# EasyEDA schematic SCH_低频电子线路电路_2025-10-19.json

## Sheets
1 Sheet_1: TITLE: Sheet_1; REV: 1.0; Date: 2025-10-13; Sheet: 1/1; Drawn By: mingtianjiufangjia; Company: Your Company
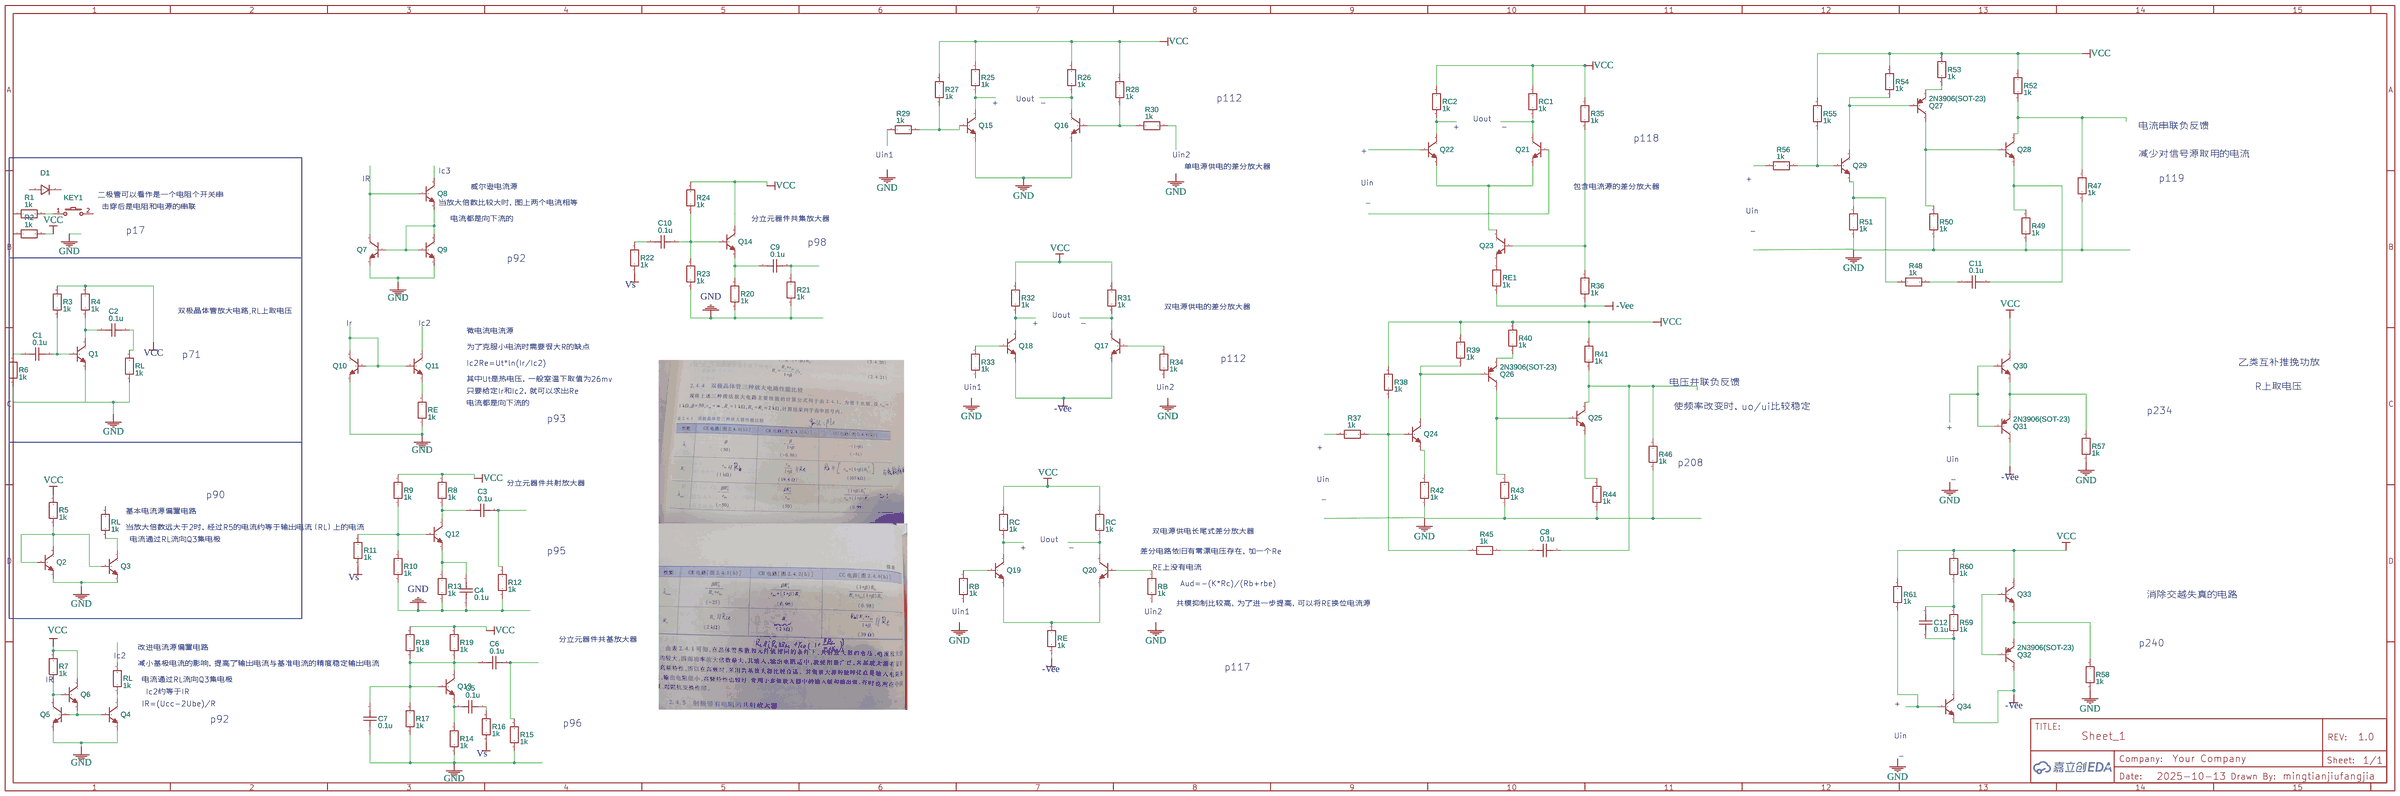
[diagram p0: Sheet_1]
2 Sheet_2: TITLE: Sheet_2; Date: 2025-10-14
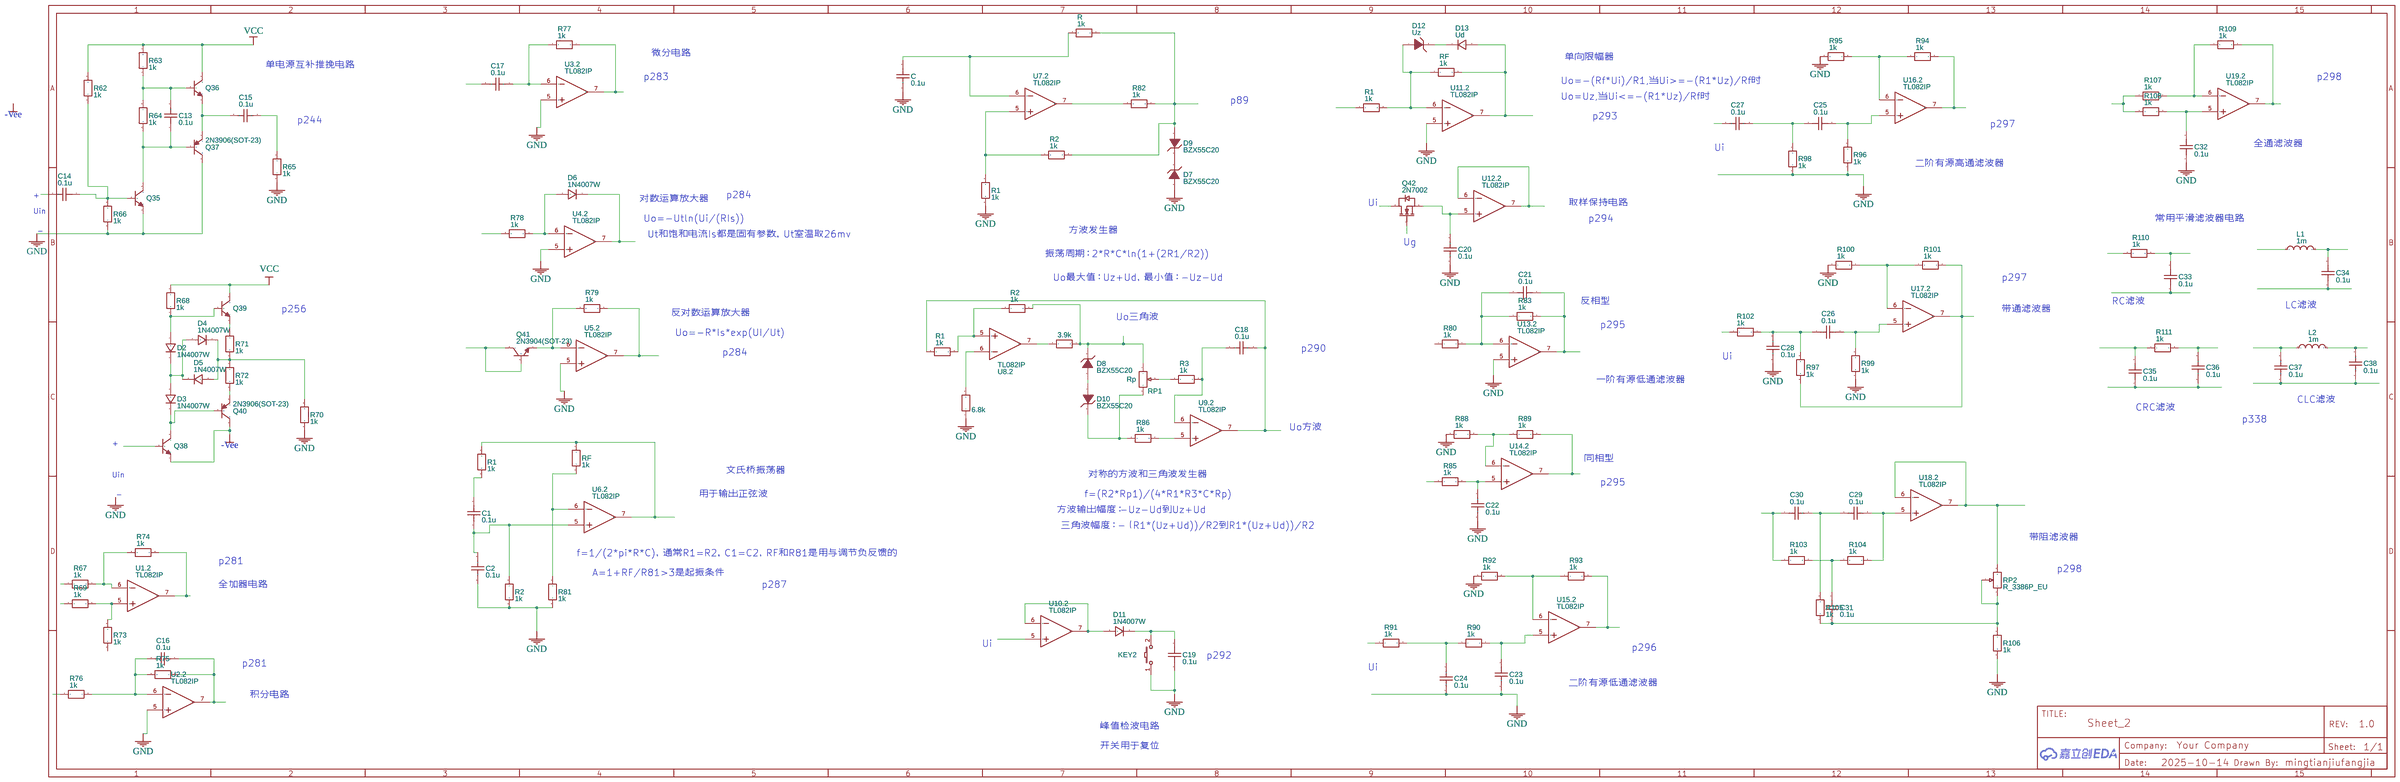
[diagram p1: Sheet_2]

## Parts
sheet Sheet_1
C1  0.1u  [C0603]
C2  0.1u  [C0603]
C3  0.1u  [C0603]
C4  0.1u  [C0603]
C5  0.1u  [C0603]
C6  0.1u  [C0603]
C7  0.1u  [C0603]
C8  0.1u  [C0603]
C9  0.1u  [C0603]
C10  0.1u  [C0603]
C11  0.1u  [C0603]
C12  0.1u  [C0603]
D1  1N4007W  [SOD-123_L2.8-W1.8-LS3.7-RD]
KEY1  K2-3.6×6.1_SMD  [KEY-SMD_2P-L6.2-W3.6-LS8.0]
Q1  2N3904(SOT-23)  [SOT-23-3_L2.9-W1.3-P1.90-LS2.4-TR]
Q2  2N3904(SOT-23)  [SOT-23-3_L2.9-W1.3-P1.90-LS2.4-TR]
Q3  2N3904(SOT-23)  [SOT-23-3_L2.9-W1.3-P1.90-LS2.4-TR]
Q4  2N3904(SOT-23)  [SOT-23-3_L2.9-W1.3-P1.90-LS2.4-TR]
Q5  2N3904(SOT-23)  [SOT-23-3_L2.9-W1.3-P1.90-LS2.4-TR]
Q6  2N3904(SOT-23)  [SOT-23-3_L2.9-W1.3-P1.90-LS2.4-TR]
Q7  2N3904(SOT-23)  [SOT-23-3_L2.9-W1.3-P1.90-LS2.4-TR]
Q8  2N3904(SOT-23)  [SOT-23-3_L2.9-W1.3-P1.90-LS2.4-TR]
Q9  2N3904(SOT-23)  [SOT-23-3_L2.9-W1.3-P1.90-LS2.4-TR]
Q10  2N3904(SOT-23)  [SOT-23-3_L2.9-W1.3-P1.90-LS2.4-TR]
Q11  2N3904(SOT-23)  [SOT-23-3_L2.9-W1.3-P1.90-LS2.4-TR]
Q12  2N3904(SOT-23)  [SOT-23-3_L2.9-W1.3-P1.90-LS2.4-TR]
Q13  2N3904(SOT-23)  [SOT-23-3_L2.9-W1.3-P1.90-LS2.4-TR]
Q14  2N3904(SOT-23)  [SOT-23-3_L2.9-W1.3-P1.90-LS2.4-TR]
Q15  2N3904(SOT-23)  [SOT-23-3_L2.9-W1.3-P1.90-LS2.4-TR]
Q16  2N3904(SOT-23)  [SOT-23-3_L2.9-W1.3-P1.90-LS2.4-TR]
Q17  2N3904(SOT-23)  [SOT-23-3_L2.9-W1.3-P1.90-LS2.4-TR]
Q18  2N3904(SOT-23)  [SOT-23-3_L2.9-W1.3-P1.90-LS2.4-TR]
Q19  2N3904(SOT-23)  [SOT-23-3_L2.9-W1.3-P1.90-LS2.4-TR]
Q20  2N3904(SOT-23)  [SOT-23-3_L2.9-W1.3-P1.90-LS2.4-TR]
Q21  2N3904(SOT-23)  [SOT-23-3_L2.9-W1.3-P1.90-LS2.4-TR]
Q22  2N3904(SOT-23)  [SOT-23-3_L2.9-W1.3-P1.90-LS2.4-TR]
Q23  2N3904(SOT-23)  [SOT-23-3_L2.9-W1.3-P1.90-LS2.4-TR]
Q24  2N3904(SOT-23)  [SOT-23-3_L2.9-W1.3-P1.90-LS2.4-TR]
Q25  2N3904(SOT-23)  [SOT-23-3_L2.9-W1.3-P1.90-LS2.4-TR]
Q26  2N3906(SOT-23)  [SOT-23-3_L2.9-W1.6-P1.90-LS2.8-TR-CW]
Q27  2N3906(SOT-23)  [SOT-23-3_L2.9-W1.6-P1.90-LS2.8-TR-CW]
Q28  2N3904(SOT-23)  [SOT-23-3_L2.9-W1.3-P1.90-LS2.4-TR]
Q29  2N3904(SOT-23)  [SOT-23-3_L2.9-W1.3-P1.90-LS2.4-TR]
Q30  2N3904(SOT-23)  [SOT-23-3_L2.9-W1.3-P1.90-LS2.4-TR]
Q31  2N3906(SOT-23)  [SOT-23-3_L2.9-W1.6-P1.90-LS2.8-TR-CW]
Q32  2N3906(SOT-23)  [SOT-23-3_L2.9-W1.6-P1.90-LS2.8-TR-CW]
Q33  2N3904(SOT-23)  [SOT-23-3_L2.9-W1.3-P1.90-LS2.4-TR]
Q34  2N3904(SOT-23)  [SOT-23-3_L2.9-W1.3-P1.90-LS2.4-TR]
R1  1k  [R0603]
R2  1k  [R0603]
R3  1k  [R0603]
R4  1k  [R0603]
R5  1k  [R0603]
R6  1k  [R0603]
R7  1k  [R0603]
R8  1k  [R0603]
R9  1k  [R0603]
R10  1k  [R0603]
R11  1k  [R0603]
R12  1k  [R0603]
R13  1k  [R0603]
R14  1k  [R0603]
R15  1k  [R0603]
R16  1k  [R0603]
R17  1k  [R0603]
R18  1k  [R0603]
R19  1k  [R0603]
R20  1k  [R0603]
R21  1k  [R0603]
R22  1k  [R0603]
R23  1k  [R0603]
R24  1k  [R0603]
R25  1k  [R0603]
R26  1k  [R0603]
R27  1k  [R0603]
R28  1k  [R0603]
R29  1k  [R0603]
R30  1k  [R0603]
R31  1k  [R0603]
R32  1k  [R0603]
R33  1k  [R0603]
R34  1k  [R0603]
R35  1k  [R0603]
R36  1k  [R0603]
R37  1k  [R0603]
R38  1k  [R0603]
R39  1k  [R0603]
R40  1k  [R0603]
R41  1k  [R0603]
R42  1k  [R0603]
R43  1k  [R0603]
R44  1k  [R0603]
R45  1k  [R0603]
R46  1k  [R0603]
R47  1k  [R0603]
R48  1k  [R0603]
R49  1k  [R0603]
R50  1k  [R0603]
R51  1k  [R0603]
R52  1k  [R0603]
R53  1k  [R0603]
R54  1k  [R0603]
R55  1k  [R0603]
R56  1k  [R0603]
R57  1k  [R0603]
R58  1k  [R0603]
R59  1k  [R0603]
R60  1k  [R0603]
R61  1k  [R0603]
RB  1k  [R0603]
RB#2  1k  [R0603]
RC  1k  [R0603]
RC1  1k  [R0603]
RC2  1k  [R0603]
RC#2  1k  [R0603]
RE  1k  [R0603]
RE1  1k  [R0603]
RE#2  1k  [R0603]
RL  1k  [R0603]
RL#2  1k  [R0603]
RL#3  1k  [R0603]
sheet Sheet_2
C  0.1u  [C0603]
C1#2  0.1u  [C0603]
C2#2  0.1u  [C0603]
C13  0.1u  [C0603]
C14  0.1u  [C0603]
C15  0.1u  [C0603]
C16  0.1u  [C0603]
C17  0.1u  [C0603]
C18  0.1u  [C0603]
C19  0.1u  [C0603]
C20  0.1u  [C0603]
C21  0.1u  [C0603]
C22  0.1u  [C0603]
C23  0.1u  [C0603]
C24  0.1u  [C0603]
C25  0.1u  [C0603]
C26  0.1u  [C0603]
C27  0.1u  [C0603]
C28  0.1u  [C0603]
C29  0.1u  [C0603]
C30  0.1u  [C0603]
C31  0.1u  [C0603]
C32  0.1u  [C0603]
C33  0.1u  [C0603]
C34  0.1u  [C0603]
C35  0.1u  [C0603]
C36  0.1u  [C0603]
C37  0.1u  [C0603]
C38  0.1u  [C0603]
D2  1N4007W  [SOD-123_L2.8-W1.8-LS3.7-RD]
D3  1N4007W  [SOD-123_L2.8-W1.8-LS3.7-RD]
D4  1N4007W  [SOD-123_L2.8-W1.8-LS3.7-RD]
D5  1N4007W  [SOD-123_L2.8-W1.8-LS3.7-RD]
D6  1N4007W  [SOD-123_L2.8-W1.8-LS3.7-RD]
D7  BZX55C20  [DO-35_BD2.0-L4.2-P8.20-D0.5-R-RD]
D8  BZX55C20  [DO-35_BD2.0-L4.2-P8.20-D0.5-R-RD]
D9  BZX55C20  [DO-35_BD2.0-L4.2-P8.20-D0.5-R-RD]
D10  BZX55C20  [DO-35_BD2.0-L4.2-P8.20-D0.5-R-RD]
D11  1N4007W  [SOD-123_L2.8-W1.8-LS3.7-RD]
D12  Uz  [DO-35_BD2.0-L4.2-P8.20-D0.5-R-RD]
D13  Ud  [SOD-123_L2.8-W1.8-LS3.7-RD]
KEY2  K2-3.6×6.1_SMD  [KEY-SMD_2P-L6.2-W3.6-LS8.0]
L1  1m  [L0603]
L2  1m  [L0603]
Q35  2N3904(SOT-23)  [SOT-23-3_L2.9-W1.3-P1.90-LS2.4-TR]
Q36  2N3904(SOT-23)  [SOT-23-3_L2.9-W1.3-P1.90-LS2.4-TR]
Q37  2N3906(SOT-23)  [SOT-23-3_L2.9-W1.6-P1.90-LS2.8-TR-CW]
Q38  2N3904(SOT-23)  [SOT-23-3_L2.9-W1.3-P1.90-LS2.4-TR]
Q39  2N3904(SOT-23)  [SOT-23-3_L2.9-W1.3-P1.90-LS2.4-TR]
Q40  2N3906(SOT-23)  [SOT-23-3_L2.9-W1.6-P1.90-LS2.8-TR-CW]
Q41  2N3904(SOT-23)  [SOT-23-3_L2.9-W1.3-P1.90-LS2.4-TR]
Q42  2N7002  [SOT-23_L2.9-W1.3-P0.95-LS2.4-BR]
R  1k  [R0603]
R1#2  1k  [R0603]
R1#3  1k  [R0603]
R1#4  1k  [R0603]
R1#5  1k  [R0603]
R2#2  1k  [R0603]
R2#3  1k  [R0603]
R2#4  1k  [R0603]
R3#2  1k  [R0603]
R62  1k  [R0603]
R63  1k  [R0603]
R64  1k  [R0603]
R65  1k  [R0603]
R66  1k  [R0603]
R67  1k  [R0603]
R68  1k  [R0603]
R69  1k  [R0603]
R70  1k  [R0603]
R71  1k  [R0603]
R72  1k  [R0603]
R73  1k  [R0603]
R74  1k  [R0603]
R75  1k  [R0603]
R76  1k  [R0603]
R77  1k  [R0603]
R78  1k  [R0603]
R79  1k  [R0603]
R80  1k  [R0603]
R81  1k  [R0603]
R82  1k  [R0603]
R83  1k  [R0603]
R84  3.9k  [R0603]
R85  1k  [R0603]
R86  1k  [R0603]
R87  6.8k  [R0603]
R88  1k  [R0603]
R89  1k  [R0603]
R90  1k  [R0603]
R91  1k  [R0603]
R92  1k  [R0603]
R93  1k  [R0603]
R94  1k  [R0603]
R95  1k  [R0603]
R96  1k  [R0603]
R97  1k  [R0603]
R98  1k  [R0603]
R99  1k  [R0603]
R100  1k  [R0603]
R101  1k  [R0603]
R102  1k  [R0603]
R103  1k  [R0603]
R104  1k  [R0603]
R105  1k  [R0603]
R106  1k  [R0603]
R107  1k  [R0603]
R108  1k  [R0603]
R109  1k  [R0603]
R110  1k  [R0603]
R111  1k  [R0603]
RF  1k  [R0603]
RF#2  1k  [R0603]
RP1  Rp  [RES-ADJ-TH_3386P]
RP2  R_3386P_EU  [RES-ADJ-TH_3386P]
U1  TL082IP  [DIP-8_L9.6-W6.4-P2.54-LS7.6-BL-1]  (section 2)
U2  TL082IP  [DIP-8_L9.6-W6.4-P2.54-LS7.6-BL-1]  (section 2)
U3  TL082IP  [DIP-8_L9.6-W6.4-P2.54-LS7.6-BL-1]  (section 2)
U4  TL082IP  [DIP-8_L9.6-W6.4-P2.54-LS7.6-BL-1]  (section 2)
U5  TL082IP  [DIP-8_L9.6-W6.4-P2.54-LS7.6-BL-1]  (section 2)
U6  TL082IP  [DIP-8_L9.6-W6.4-P2.54-LS7.6-BL-1]  (section 2)
U7  TL082IP  [DIP-8_L9.6-W6.4-P2.54-LS7.6-BL-1]  (section 2)
U8  TL082IP  [DIP-8_L9.6-W6.4-P2.54-LS7.6-BL-1]  (section 2)
U9  TL082IP  [DIP-8_L9.6-W6.4-P2.54-LS7.6-BL-1]  (section 2)
U10  TL082IP  [DIP-8_L9.6-W6.4-P2.54-LS7.6-BL-1]  (section 2)
U11  TL082IP  [DIP-8_L9.6-W6.4-P2.54-LS7.6-BL-1]  (section 2)
U12  TL082IP  [DIP-8_L9.6-W6.4-P2.54-LS7.6-BL-1]  (section 2)
U13  TL082IP  [DIP-8_L9.6-W6.4-P2.54-LS7.6-BL-1]  (section 2)
U14  TL082IP  [DIP-8_L9.6-W6.4-P2.54-LS7.6-BL-1]  (section 2)
U15  TL082IP  [DIP-8_L9.6-W6.4-P2.54-LS7.6-BL-1]  (section 2)
U16  TL082IP  [DIP-8_L9.6-W6.4-P2.54-LS7.6-BL-1]  (section 2)
U17  TL082IP  [DIP-8_L9.6-W6.4-P2.54-LS7.6-BL-1]  (section 2)
U18  TL082IP  [DIP-8_L9.6-W6.4-P2.54-LS7.6-BL-1]  (section 2)
U19  TL082IP  [DIP-8_L9.6-W6.4-P2.54-LS7.6-BL-1]  (section 2)

## Library data of the parts
C C1 C1#2 C2 C2#2 C3-C38 = C_0603_US: Contributor: LCEDA_Lib
D1-D6 D11 D13 = 1N4007W: Supplier: LCSC; Supplier Part: C328592; Manufacturer: BLUE ROCKET; Contributor: LCEDA_Lib
KEY1 KEY2 = K2-3.6×6.1_SMD: Supplier Part: C118141; Supplier: LCSC; Manufacturer Part: K2-1107ST-A4SW-06; Contributor: LCEDA_Lib; 制造商: 韩国韩荣
Q1-Q25 Q28-Q30 Q33-Q36 Q38 Q39 Q41 = 2N3904(SOT-23): Supplier: LCSC; Manufacturer: KEC; Manufacturer Part: 2n3904S-RTK/PS; Supplier Part: C18536; Paste Type: SOT-23; Contributor: LCEDA_Lib
Q26 Q27 Q31 Q32 Q37 Q40 = 2N3906(SOT-23): Supplier: LCSC; Manufacturer: KEC; Manufacturer Part: 2N3906S-RTK/PS; Contributor: LCEDA_Lib; Supplier Part: C147294
R R1 R1#2-R1#5 R2 R2#2-R2#4 R3 R3#2 R4-R111 RB RB#2 RC RC1 RC2 RC#2 RE RE1 RE#2 RF RF#2 RL RL#2 RL#3 = R_0603_EU: Contributor: LCEDA_Lib
D7-D10 D12 = BZX55C20: Supplier: LCSC; Manufacturer: ST(先科); Supplier Part: C2526; JLCPCB Part Class: Extended Part
L1 L2 = L0603_US: Contributor: LCEDA_Lib
Q42 = 2N7002: Supplier: LCSC; Manufacturer: Nexperia; Manufacturer Part: 2N7002,215; image: //image.lceda.cn/szlcsc/C65189.jpg; Supplier Part: C65189; Paste Type: expand; Contributor: LCEDA_Lib
RP1 RP2 = R_3386P_EU: Supplier: LCSC; Contributor: LCEDA_Lib; Value(Ω): 10K
U1-U19 = TL082IP: subpart_no: 2; Supplier: LCSC; Supplier Part: C189972; Manufacturer: TI(德州仪器); JLCPCB Part Class: Extended Part

## Nets
-Vee: Q17.1(E) Q18.1(E) Q31.3(C) Q32.3(C) Q34.1(E) Q38.1(E) Q40.3(C) R36.1 RE1.2 RE#2.2
GND: C.2 C2#2.2 C4.1 C7.1 C19.1 C20.1 C22.2 C23.2 C24.2 C28.1 C32.1 D7.1(A) KEY2.1 Q1.1(E) Q2.1(E) Q3.1(E) Q4.1(E) Q5.1(E) Q7.1(E) Q9.1(E) Q10.1(E) Q15.1(E) Q16.1(E) Q35.1(E) Q37.3(C) R1#3.2 R2#2.2 R6.1 R10.1 R12.1 R13.1 R14.1 R15.1 R17.1 R20.1 R21.1 R23.1 R43.1 R44.1 R46.2 R47.2 R49.1 R50.1 R57.1 R58.1 R65.1 R66.1 R70.1 R81.2 R87.1 R88.1 R92.1 R95.1 R96.1 R98.1 R99.1 R100.1 R106.1 RE.1 RL.1 U2.5(2IN+) U3.5(2IN+) U4.5(2IN+) U5.5(2IN+) U11.5(2IN+) U13.5(2IN+)
VCC: Q6.3(C) Q14.3(C) Q30.3(C) Q33.3(C) Q36.3(C) Q39.3(C) R2.2 R3.2 R4.2 R5.2 R7.2 R8.2 R9.2 R18.2 R19.2 R24.2 R25.2 R26.2 R27.2 R28.2 R31.2 R32.2 R35.2 R38.2 R39.2 R40.2 R41.2 R52.2 R53.2 R54.2 R55.2 R60.2 R61.2 R62.2 R63.2 R68.2 RC.2 RC1.2 RC2.2 RC#2.2
Vs: R11.1 R16.1 R22.1
Net-(C1#2-1): C1#2.1 R1#2.2
Net-(C1#2-2): C1#2.2 C2#2.1 R2#2.1 U6.5(2IN+)
Net-(C1-1): C1.1 R6.2
Net-(C1-2): C1.2 Q1.2(B) R3.1
Net-(C2-1): C2.1 Q1.3(C) R4.1
Net-(C2-2): C2.2 RL.2
Net-(C3-1): C3.1 Q12.3(C) R8.1
Net-(C3-2): C3.2 R12.2
Net-(C4-2): C4.2 Q12.1(E) R13.2
Net-(C5-1): C5.1 R16.2
Net-(C5-2): C5.2 Q13.1(E) R14.2
Net-(C6-1): C6.1 C7.2 Q13.2(B) Q13.3(C) R17.2 R18.1 R19.1
Net-(C6-2): C6.2 R15.2
Net-(C8-1): C8.1 R45.1
Net-(C8-2): C8.2 Q25.3(C) R41.1 R46.1
Net-(C9-1): C9.1 Q14.1(E) R20.2
Net-(C9-2): C9.2 R21.2
Net-(C10-1): C10.1 R22.2
Net-(C10-2): C10.2 Q14.2(B) R23.2 R24.1
Net-(C11-1): C11.1 R48.1
Net-(C11-2): C11.2 Q28.1(E) R49.2
Net-(C12-1): C12.1 Q34.3(C) R59.1
Net-(C12-2): C12.2 R59.2 R60.1
Net-(C13-1): C13.1 Q35.3(C) Q37.2(B) R64.1
Net-(C13-2): C13.2 Q36.2(B) R63.1 R64.2
Net-(C14-1): C14.1 Q35.2(B) R62.1 R66.2
Net-(C15-1): C15.1 R65.2
Net-(C15-2): C15.2 Q36.1(E) Q37.1(E)
Net-(C16-1): C16.1 R75.1 U2.7(2OUT)
Net-(C16-2): C16.2 R75.2 R76.1 U2.6(2IN-)
Net-(C17-1): C17.1 R77.2 U3.6(2IN-)
Net-(C18-1): C18.1 R3#2.2 U9.6(2IN-)
Net-(C18-2): C18.2 R1#4.1 U9.7(2OUT)
Net-(C19-2): C19.2 D11.1 KEY2.2
Net-(C20-2): C20.2 Q42.2(S) U12.5(2IN+)
Net-(C21-1): C21.1 R83.2 U13.7(2OUT)
Net-(C21-2): C21.2 R80.2 R83.1 U13.6(2IN-)
Net-(C22-1): C22.1 R85.2 U14.5(2IN+)
Net-(C23-1): C23.1 R90.2 U15.5(2IN+)
Net-(C24-1): C24.1 R90.1 R91.2
Net-(C25-1): C25.1 C27.2 R98.2
Net-(C25-2): C25.2 R96.2 U16.5(2IN+)
Net-(C26-1): C26.1 C28.2 R97.2 R102.1
Net-(C26-2): C26.2 R99.2 U17.5(2IN+)
Net-(C29-1): C29.1 C30.2 R105.2
Net-(C29-2): C29.2 R104.2 U18.5(2IN+)
Net-(C30-1): C30.1 R103.1
Net-(C31-1): C31.1 R105.1 R106.2 RP2.1 RP2.2
Net-(C31-2): C31.2 R103.2 R104.1
Net-(C32-2): C32.2 R108.2 U19.5(2IN+)
Net-(C33-2): C33.2 R110.2
Net-(C34-2): C34.2 L1.2
Net-(C35-1): C35.1 C36.1
Net-(C35-2): C35.2 R111.1
Net-(C36-2): C36.2 R111.2
Net-(C37-1): C37.1 C38.1
Net-(C37-2): C37.2 L2.1
Net-(C38-2): C38.2 L2.2
Net-(C-1): C.1 R.1 U7.6(2IN-)
Net-(D2-1): D2.1 D3.2 D4.2 D5.1
Net-(D2-2): D2.2 Q39.2(B) R68.1
Net-(D3-1): D3.1 Q38.3(C) Q40.2(B)
Net-(D4-1): D4.1 D5.2 R70.2 R71.1 R72.2
Net-(D6-1): D6.1 U4.7(2OUT)
Net-(D6-2): D6.2 R78.1 U4.6(2IN-)
Net-(D7-2): D7.2(K) D9.2(K)
Net-(D8-1): D8.1(A) D10.1(A)
Net-(D8-2): D8.2(K) R2#4.2 R84.2 RP1.1
Net-(D9-1): D9.1(A) R.2 R2#3.2 R82.2
Net-(D10-2): D10.2(K) R86.1 RP1.3
Net-(D11-2): D11.2 U10.6(2IN-) U10.7(2OUT)
Net-(D12-1): D12.1(A) R1#5.2 RF#2.1 U11.6(2IN-)
Net-(D12-2): D12.2(K) D13.1
Net-(D13-2): D13.2 RF#2.2 U11.7(2OUT)
Net-(KEY1-1): KEY1.1 R1.2
Net-(Q2-2): Q2.2(B) Q2.3(C) Q3.2(B) R5.1
Net-(Q3-3): Q3.3(C) RL#2.1
Net-(Q4-2): Q4.2(B) Q5.2(B) Q6.1(E)
Net-(Q4-3): Q4.3(C) RL#3.1
Net-(Q5-3): Q5.3(C) Q6.2(B) R7.1
Net-(Q7-2): Q7.2(B) Q8.1(E) Q9.2(B) Q9.3(C)
Net-(Q7-3): Q7.3(C) Q8.2(B)
Net-(Q10-2): Q10.2(B) Q10.3(C) Q11.2(B)
Net-(Q11-1): Q11.1(E) RE.2
Net-(Q12-2): Q12.2(B) R9.1 R10.2 R11.2
Net-(Q15-2): Q15.2(B) R27.1 R29.2
Net-(Q15-3): Q15.3(C) R25.1
Net-(Q16-2): Q16.2(B) R28.1 R30.2
Net-(Q16-3): Q16.3(C) R26.1
Net-(Q17-2): Q17.2(B) R34.1
Net-(Q17-3): Q17.3(C) R31.1
Net-(Q18-2): Q18.2(B) R33.2
Net-(Q18-3): Q18.3(C) R32.1
Net-(Q19-1): Q19.1(E) Q20.1(E) RE#2.1
Net-(Q19-2): Q19.2(B) RB#2.2
Net-(Q19-3): Q19.3(C) RC.1
Net-(Q20-2): Q20.2(B) RB.1
Net-(Q20-3): Q20.3(C) RC#2.1
Net-(Q21-1): Q21.1(E) Q22.1(E) Q23.3(C)
Net-(Q21-3): Q21.3(C) RC1.1
Net-(Q22-3): Q22.3(C) RC2.1
Net-(Q23-1): Q23.1(E) RE1.1
Net-(Q23-2): Q23.2(B) R35.1 R36.2
Net-(Q24-1): Q24.1(E) R42.2
Net-(Q24-2): Q24.2(B) R37.2 R38.1 R45.2
Net-(Q24-3): Q24.3(C) Q26.2(B) R39.1
Net-(Q25-1): Q25.1(E) R44.2
Net-(Q25-2): Q25.2(B) Q26.3(C) R43.2
Net-(Q26-1): Q26.1(E) R40.1
Net-(Q27-1): Q27.1(E) R53.1
Net-(Q27-2): Q27.2(B) Q29.3(C) R54.1
Net-(Q27-3): Q27.3(C) Q28.2(B) R50.2
Net-(Q28-3): Q28.3(C) R47.1 R52.1
Net-(Q29-1): Q29.1(E) R48.2 R51.2
Net-(Q29-2): Q29.2(B) R55.1 R56.2
Net-(Q30-1): Q30.1(E) Q31.1(E) R57.2
Net-(Q30-2): Q30.2(B) Q31.2(B)
Net-(Q32-1): Q32.1(E) Q33.1(E) R58.2
Net-(Q32-2): Q32.2(B) Q33.2(B)
Net-(Q34-2): Q34.2(B) R61.1
Net-(Q39-1): Q39.1(E) R71.2
Net-(Q40-1): Q40.1(E) R72.1
Net-(Q41-1): Q41.1(E) R79.2 U5.6(2IN-)
Net-(Q41-2): Q41.2(B) Q41.3(C)
Net-(R1#2-1): R1#2.1 RF.1 U6.7(2OUT)
Net-(R1#3-1): R1#3.1 R2#3.1 U7.5(2IN+)
Net-(R1#4-2): R1#4.2 R2#4.1 U8.5(2IN+)
Net-(R3#2-1): R3#2.1 RP1.2
Net-(R67-1): R67.1 R74.2 U1.6(2IN-)
Net-(R69-1): R69.1 R73.2 U1.5(2IN+)
Net-(R74-1): R74.1 U1.7(2OUT)
Net-(R77-1): R77.1 U3.7(2OUT)
Net-(R79-1): R79.1 U5.7(2OUT)
Net-(R81-1): R81.1 RF.2 U6.6(2IN-)
Net-(R82-1): R82.1 U7.7(2OUT)
Net-(R84-1): R84.1 U8.7(2OUT)
Net-(R86-2): R86.2 U9.5(2IN+)
Net-(R87-2): R87.2 U8.6(2IN-)
Net-(R88-2): R88.2 R89.1 U14.6(2IN-)
Net-(R89-2): R89.2 U14.7(2OUT)
Net-(R92-2): R92.2 R93.1 U15.6(2IN-)
Net-(R93-2): R93.2 U15.7(2OUT)
Net-(R94-1): R94.1 R95.2 U16.6(2IN-)
Net-(R94-2): R94.2 U16.7(2OUT)
Net-(R97-1): R97.1 R101.2 U17.7(2OUT)
Net-(R100-2): R100.2 R101.1 U17.6(2IN-)
Net-(R107-1): R107.1 R108.1
Net-(R107-2): R107.2 R109.1 U19.6(2IN-)
Net-(R109-2): R109.2 U19.7(2OUT)
Net-(RP2-3): RP2.3 U18.6(2IN-) U18.7(2OUT)
Net-(U12.2-6): U12.6(2IN-) U12.7(2OUT)

Not connected (* = marked no-connect by the designer): C14 2; C17 2; C27 1; C33 1; C34 1; D1 1 2; KEY1 2; L1 1; Q8 3(C); Q11 3(C); Q21 2(B); Q22 2(B); Q38 2(B); Q42 1(G) 3(D); R1 1; R1#5 1; R2 1; R29 1; R30 1; R33 1; R34 2; R37 1; R42 1; R51 1; R56 1; R67 2; R69 2; R73 1; R76 2; R78 2; R80 1; R85 1; R91 1; R102 2; R110 1; RB 2; RB#2 1; RL#2 2; RL#3 2; U10 5(2IN+)

## Notes on the sheets
sheet 1
- p112
- +
- Uout
- -
- Uout
- 电流串联负反馈
- +
- -
- p118
- +
- 减少对信号源取用的电流
- Uin1
- Uin2
- Ic3
- 单电源供电的差分放大器
- IR
- Uin
- +
- p119
- 威尔逊电流源
- 包含电流源的差分放大器
- 二极管可以看作是一个电阻个开关串
- 击穿后是电阻和电源的串联
- 当放大倍数比较大时，图上两个电流相等
- -
- Uin
- 电流都是向下流的
- 分立元器件共集放大器
- p17
- -
- p98
- p92
- 双极晶体管放大电路,RL上取电压
- Uout
- 双电源供电的差分放大器
- Ir
- Ic2
- +
- -
- 微电流电流源
- 为了克服小电流时需要很大R的缺点
- p71
- p112
- 乙类互补推挽功放
- Ic2Re=Ut*ln(Ir/Ic2)
- 其中Ut是热电压，一般室温下取值为26mv
- 电压并联负反馈
- Uin1
- Uin2
- R上取电压
- 只要给定Ir和Ic2，就可以求出Re
- 电流都是向下流的
- 使频率改变时，uo/ui比较稳定
- p234
- p93
- +
- +
- p208
- Uin
- 分立元器件共射放大器
- Uin
- -
- p90
- -
- 基本电流源偏置电路
- 当放大倍数远大于2时，经过R5的电流约等于输出电流（RL）上的电流
- 双电源供电长尾式差分放大器
- 电流通过RL流向Q3集电极
- Uout
- p95
- +
- -
- 差分电路依旧有零漂电压存在，加一个Re
- RE上没有电流
- Aud=-(K*Rc)/(Rb+rbe)
- 消除交越失真的电路
- 共模抑制比较高，为了进一步提高，可以将RE换位电流源
- Uin1
- Uin2
- 分立元器件共基放大器
- p240
- Ic2
- 改进电流源偏置电路
- 减小基极电流的影响，提高了输出电流与基准电流的精度稳定输出电流
- p117
- IR
- 电流通过RL流向Q3集电极
- Ic2约等于IR
- IR=(Ucc-2Ube)/R
- +
- p92
- p96
- Uin
- -
sheet 2
- 微分电路
- 单向限幅器
- 单电源互补推挽电路
- p283
- p298
- Uo=-(Rf*Ui)/R1,当Ui>=-(R1*Uz)/Rf时
- Uo=Uz,当Ui<=-(R1*Uz)/Rf时
- p89
- p244
- p293
- p297
- Ui
- 全通滤波器
- 二阶有源高通滤波器
- +
- 对数运算放大器
- p284
- Ui
- 取样保持电路
- Uin
- Uo=-Utln(Ui/(RIs))
- p294
- 常用平滑滤波器电路
- -
- Ut和饱和电流Is都是固有参数，Ut室温取26mv
- 方波发生器
- Ug
- 振荡周期：2*R*C*ln(1+(2R1/R2))
- Uo最大值：Uz+Ud，最小值：-Uz-Ud
- p297
- 反相型
- RC滤波
- p256
- 带通滤波器
- LC滤波
- 反对数运算放大器
- Uo三角波
- p295
- Uo=-R*Is*exp(UI/Ut)
- p284
- p290
- Ui
- 一阶有源低通滤波器
- CLC滤波
- CRC滤波
- p338
- Uo方波
- +
- 同相型
- Uin
- 文氏桥振荡器
- 对称的方波和三角波发生器
- p295
- -
- 用于输出正弦波
- f=(R2*Rp1)/(4*R1*R3*C*Rp)
- 方波输出幅度：
- -Uz-Ud到Uz+Ud
- 三角波幅度：-（R1*(Uz+Ud))/R2到R1*(Uz+Ud))/R2
- 带阻滤波器
- p281
- f=1/(2*pi*R*C)，通常R1=R2，C1=C2，RF和R81是用与调节负反馈的
- p298
- A=1+RF/R81>3是起振条件
- 全加器电路
- p287
- Ui
- p296
- p281
- p292
- Ui
- 二阶有源低通滤波器
- 积分电路
- 峰值检波电路
- 开关用于复位
